# EAGLE design mercedes_shield_v1_ (EAGLE 5.11)
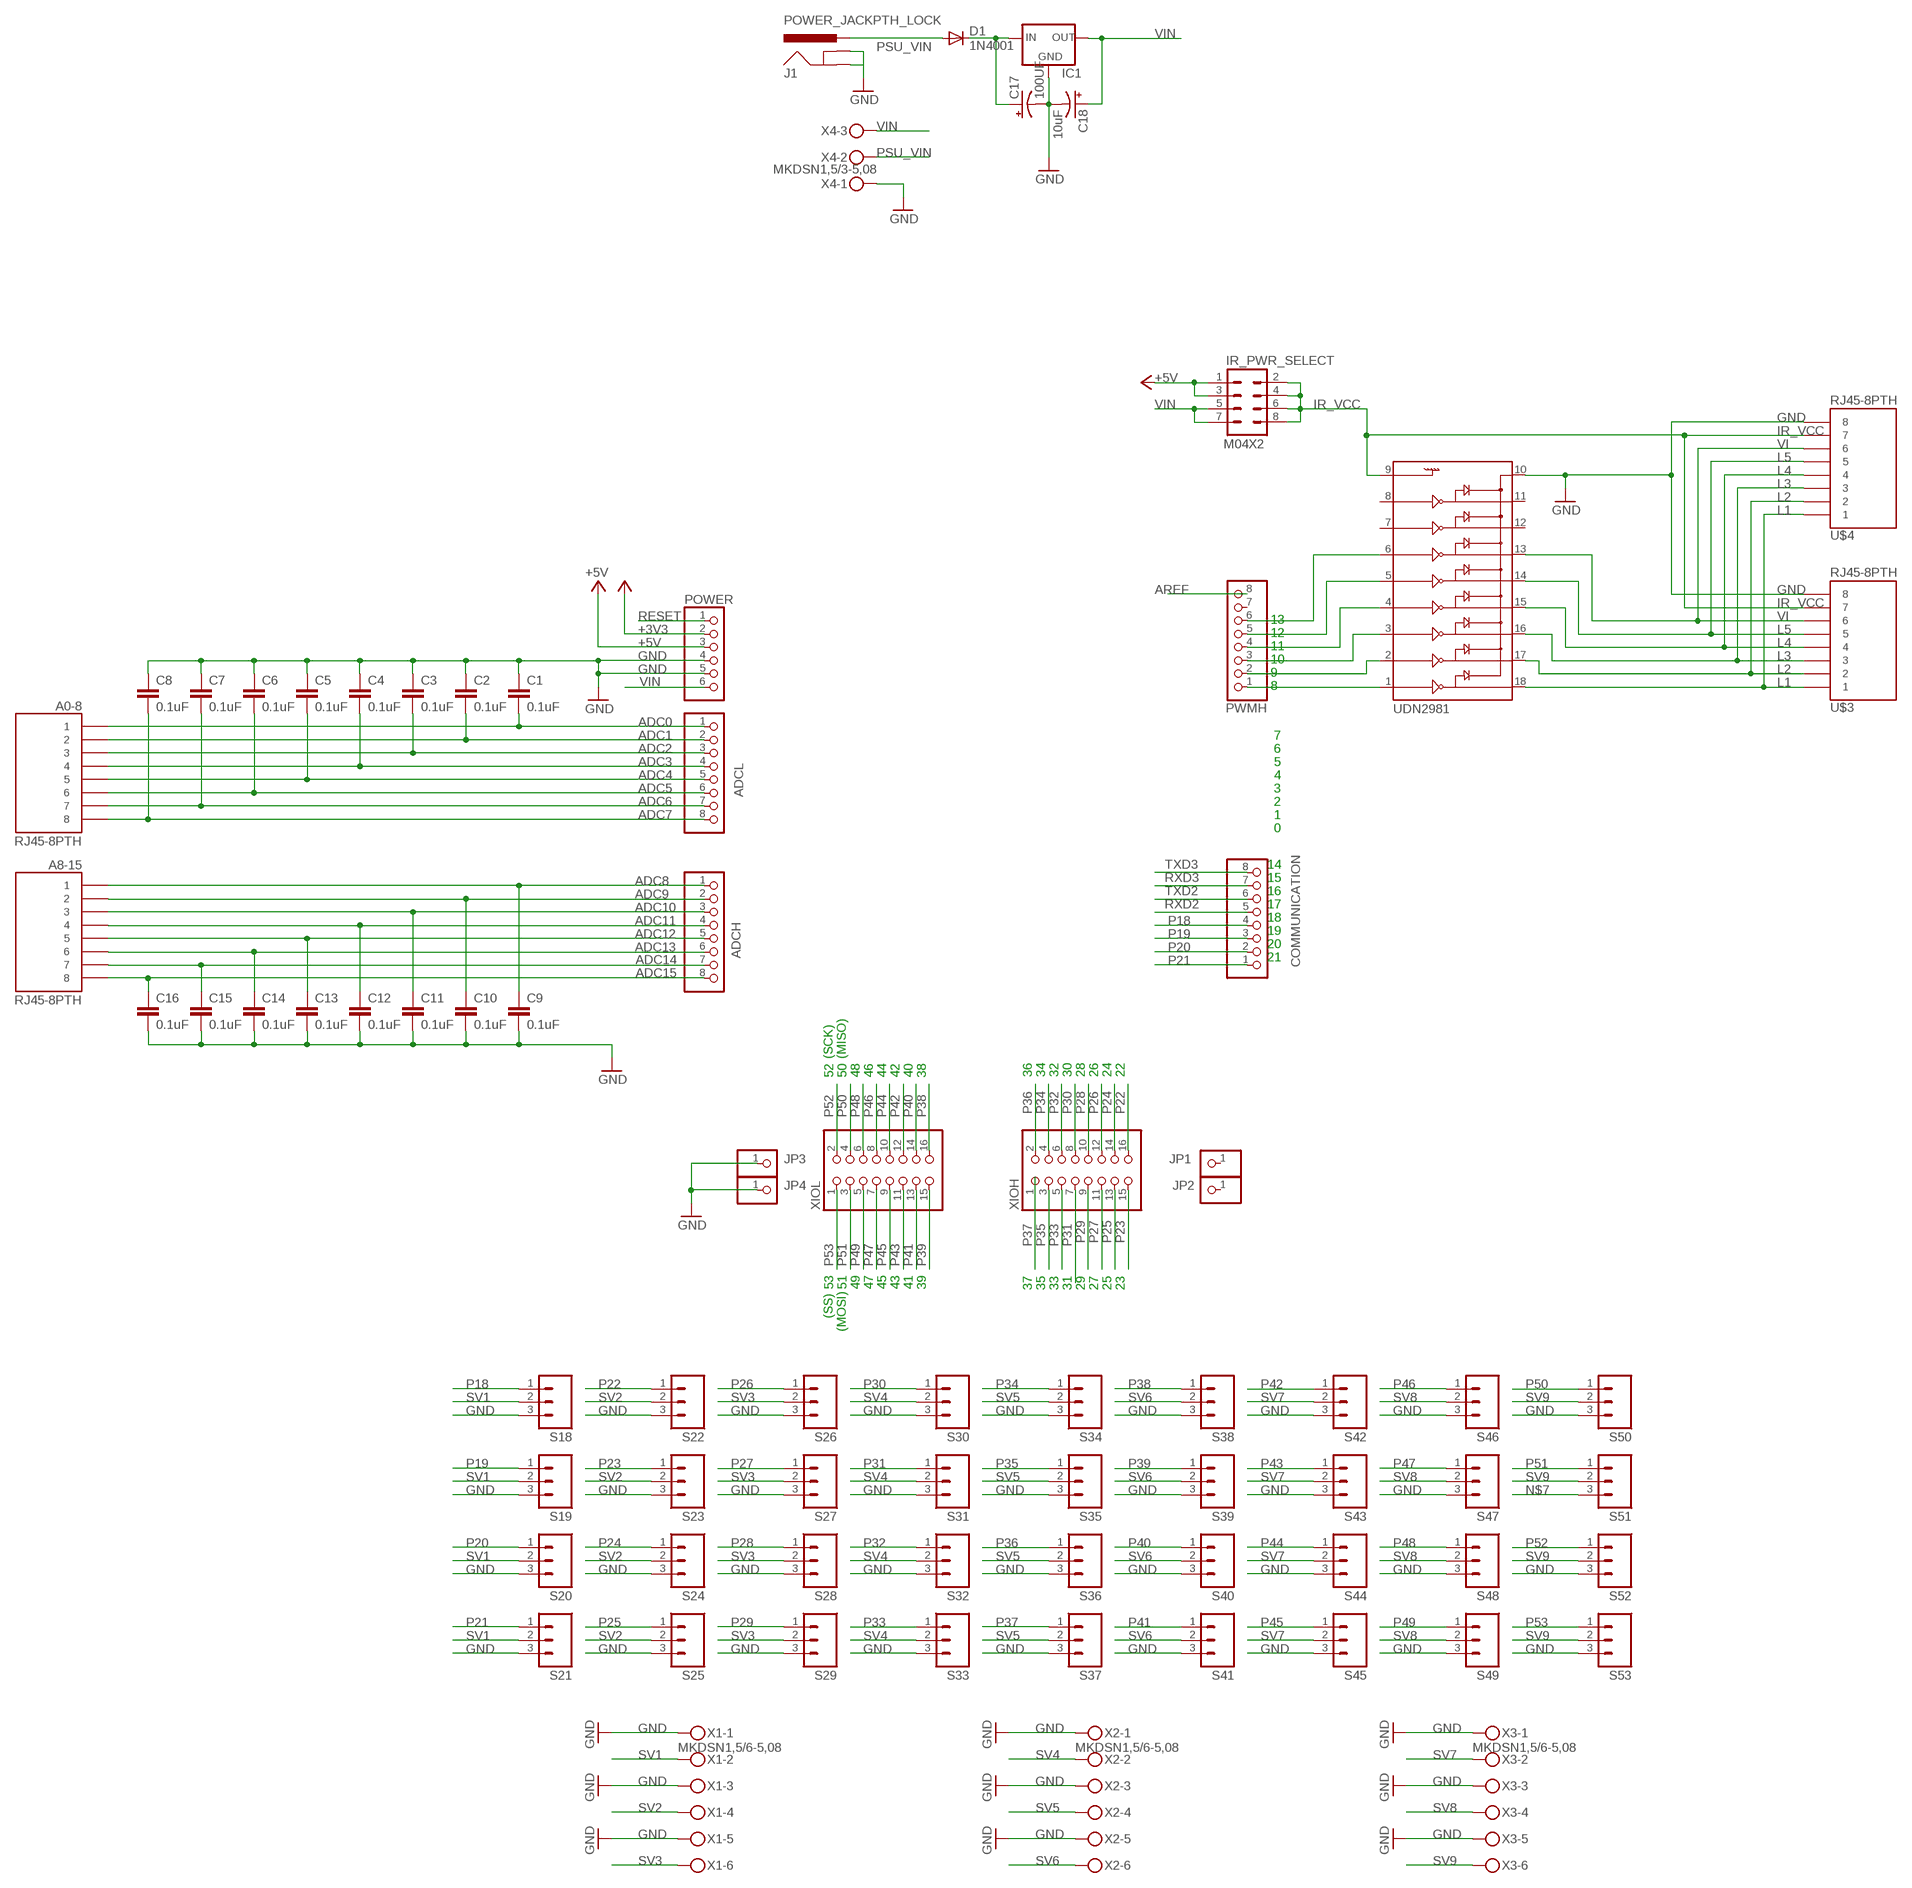
[diagram p0: schematic, sheet 1]

## Parts
A0-8  RJ45-8PTH  [RJ45-8]
A8-15  RJ45-8PTH  [RJ45-8]
ADCH  PINHD-1X8  [1X08]
ADCL  PINHD-1X8  [1X08]
C1  0.1uF  CAPPTH  [CAP-PTH-SMALL]
C2  0.1uF  CAPPTH  [CAP-PTH-SMALL]
C3  0.1uF  CAPPTH  [CAP-PTH-SMALL]
C4  0.1uF  CAPPTH  [CAP-PTH-SMALL]
C5  0.1uF  CAPPTH  [CAP-PTH-SMALL]
C6  0.1uF  CAPPTH  [CAP-PTH-SMALL]
C7  0.1uF  CAPPTH  [CAP-PTH-SMALL]
C8  0.1uF  CAPPTH  [CAP-PTH-SMALL]
C9  0.1uF  CAPPTH  [CAP-PTH-SMALL]
C10  0.1uF  CAPPTH  [CAP-PTH-SMALL]
C11  0.1uF  CAPPTH  [CAP-PTH-SMALL]
C12  0.1uF  CAPPTH  [CAP-PTH-SMALL]
C13  0.1uF  CAPPTH  [CAP-PTH-SMALL]
C14  0.1uF  CAPPTH  [CAP-PTH-SMALL]
C15  0.1uF  CAPPTH  [CAP-PTH-SMALL]
C16  0.1uF  CAPPTH  [CAP-PTH-SMALL]
C17  100UF  CAP_POLPTH1  [CPOL-RADIAL-100UF-25V]
C18  10uF  CAP_POLPTH2  [CPOL-RADIAL-10UF-25V]
COMMUNICATION  PINHD-1X8  [1X08]
D1  1N4001  DIODESMA  [SMA-DIODE]
IC1  V_REG_78XX-TO-220  [TO-220-ALT]
IR_PWR_SELECT  M04X2  [2X4]
J1  POWER_JACKPTH_LOCK  [POWER_JACK_PTH_LOCK]
JP1  PINHD-1X1  [1X01]
JP2  PINHD-1X1  [1X01]
JP3  PINHD-1X1  [1X01]
JP4  PINHD-1X1  [1X01]
POWER  PINHD-1X6  [1X06]
PWMH  PINHD-1X8  [1X08]
S18  M03PTH  [1X03]
S19  M03PTH  [1X03]
S20  M03PTH  [1X03]
S21  M03PTH  [1X03]
S22  M03PTH  [1X03]
S23  M03PTH  [1X03]
S24  M03PTH  [1X03]
S25  M03PTH  [1X03]
S26  M03PTH  [1X03]
S27  M03PTH  [1X03]
S28  M03PTH  [1X03]
S29  M03PTH  [1X03]
S30  M03PTH  [1X03]
S31  M03PTH  [1X03]
S32  M03PTH  [1X03]
S33  M03PTH  [1X03]
S34  M03PTH  [1X03]
S35  M03PTH  [1X03]
S36  M03PTH  [1X03]
S37  M03PTH  [1X03]
S38  M03PTH  [1X03]
S39  M03PTH  [1X03]
S40  M03PTH  [1X03]
S41  M03PTH  [1X03]
S42  M03PTH  [1X03]
S43  M03PTH  [1X03]
S44  M03PTH  [1X03]
S45  M03PTH  [1X03]
S46  M03PTH  [1X03]
S47  M03PTH  [1X03]
S48  M03PTH  [1X03]
S49  M03PTH  [1X03]
S50  M03PTH  [1X03]
S51  M03PTH  [1X03]
S52  M03PTH  [1X03]
S53  M03PTH  [1X03]
U$3  RJ45-8PTH  [RJ45-8]
U$4  RJ45-8PTH  [RJ45-8]
UDN2981  ULN2803DIP  [DIL18]
X1  MKDSN1,5/6-5,08  [MKDSN1,5/6-5,08]
X2  MKDSN1,5/6-5,08  [MKDSN1,5/6-5,08]
X3  MKDSN1,5/6-5,08  [MKDSN1,5/6-5,08]
X4  MKDSN1,5/3-5,08  [MKDSN1,5/3-5,08]
XIOH  PINHD-2X8  [2X08]
XIOL  PINHD-2X8  [2X08]

## Nets
+3V3: POWER.2
+5V: IR_PWR_SELECT.1 IR_PWR_SELECT.3 POWER.3
ADC0: A0-8.1 ADCL.1 C1.2
ADC1: A0-8.2 ADCL.2 C2.2
ADC2: A0-8.3 ADCL.3 C3.2
ADC3: A0-8.4 ADCL.4 C4.2
ADC4: A0-8.5 ADCL.5 C5.2
ADC5: A0-8.6 ADCL.6 C6.2
ADC6: A0-8.7 ADCL.7 C7.2
ADC7: A0-8.8 ADCL.8 C8.2
ADC8: A8-15.1 ADCH.1 C9.1
ADC9: A8-15.2 ADCH.2 C10.1
ADC10: A8-15.3 ADCH.3 C11.1
ADC11: A8-15.4 ADCH.4 C12.1
ADC12: A8-15.5 ADCH.5 C13.1
ADC13: A8-15.6 ADCH.6 C14.1
ADC14: A8-15.7 ADCH.7 C15.1
ADC15: A8-15.8 ADCH.8 C16.1
AREF: PWMH.8
GND: C1.1 C2.1 C3.1 C4.1 C5.1 C6.1 C7.1 C8.1 C9.2 C10.2 C11.2 C12.2 C13.2 C14.2 C15.2 C16.2 C17.2(-) C18.2(-) IC1.GND J1.GND J1.GNDBREAK JP3.1 JP4.1 POWER.4 POWER.5 S18.3 S19.3 S20.3 S21.3 S22.3 S23.3 S24.3 S25.3 S26.3 S27.3 S28.3 S29.3 S30.3 S31.3 S32.3 S33.3 S34.3 S35.3 S36.3 S37.3 S38.3 S39.3 S40.3 S41.3 S42.3 S43.3 S44.3 S45.3 S46.3 S47.3 S48.3 S49.3 S50.3 S52.3 S53.3 U$3.8 U$4.8 UDN2981.10 X1.1 X1.3 X1.5 X2.1 X2.3 X2.5 X3.1 X3.3 X3.5 X4.1
IR_VCC: IR_PWR_SELECT.2 IR_PWR_SELECT.4 IR_PWR_SELECT.6 IR_PWR_SELECT.8 U$3.7 U$4.7 UDN2981.9
L1: U$3.1 U$4.1 UDN2981.18
L2: U$3.2 U$4.2 UDN2981.17
L3: U$3.3 U$4.3 UDN2981.16
L4: U$3.4 U$4.4 UDN2981.15
L5: U$3.5 U$4.5 UDN2981.14
N$1: PWMH.1 UDN2981.1
N$2: PWMH.2 UDN2981.2
N$3: PWMH.3 UDN2981.3
N$4: PWMH.4 UDN2981.4
N$5: PWMH.5 UDN2981.5
N$6: PWMH.6 UDN2981.6
N$7: S51.3
N$10: C17.1(+) D1.C IC1.IN
P18: COMMUNICATION.4 S18.1
P19: COMMUNICATION.3 S19.1
P20: COMMUNICATION.2 S20.1
P21: COMMUNICATION.1 S21.1
P22: S22.1 XIOH.16
P23: S23.1 XIOH.15
P24: S24.1 XIOH.14
P25: S25.1 XIOH.13
P26: S26.1 XIOH.12
P27: S27.1 XIOH.11
P28: S28.1 XIOH.10
P29: S29.1 XIOH.9
P30: S30.1 XIOH.8
P31: S31.1 XIOH.7
P32: S32.1 XIOH.6
P33: S33.1 XIOH.5
P34: S34.1 XIOH.4
P35: S35.1 XIOH.3
P36: S36.1 XIOH.2
P37: S37.1 XIOH.1
P38: S38.1 XIOL.16
P39: S39.1 XIOL.15
P40: S40.1 XIOL.14
P41: S41.1 XIOL.13
P42: S42.1 XIOL.12
P43: S43.1 XIOL.11
P44: S44.1 XIOL.10
P45: S45.1 XIOL.9
P46: S46.1 XIOL.8
P47: S47.1 XIOL.7
P48: S48.1 XIOL.6
P49: S49.1 XIOL.5
P50: S50.1 XIOL.4
P51: S51.1 XIOL.3
P52: S52.1 XIOL.2
P53: S53.1 XIOL.1
PSU_VIN: D1.A J1.PWR X4.2
RESET: POWER.1
RXD2: COMMUNICATION.5
RXD3: COMMUNICATION.7
SV1: S18.2 S19.2 S20.2 S21.2 X1.2
SV2: S22.2 S23.2 S24.2 S25.2 X1.4
SV3: S26.2 S27.2 S28.2 S29.2 X1.6
SV4: S30.2 S31.2 S32.2 S33.2 X2.2
SV5: S34.2 S35.2 S36.2 S37.2 X2.4
SV6: S38.2 S39.2 S40.2 S41.2 X2.6
SV7: S42.2 S43.2 S44.2 S45.2 X3.2
SV8: S46.2 S47.2 S48.2 S49.2 X3.4
SV9: S50.2 S51.2 S52.2 S53.2 X3.6
TXD2: COMMUNICATION.6
TXD3: COMMUNICATION.8
VI: U$3.6 U$4.6 UDN2981.13
VIN: C18.1(+) IC1.OUT IR_PWR_SELECT.5 IR_PWR_SELECT.7 POWER.6 X4.3
Unconnected: JP1.1 JP2.1 PWMH.7 UDN2981.7 UDN2981.8 UDN2981.11 UDN2981.12

## Notes on the sheet
- 13
- 12
- 11
- 10
- 9
- 8
- 7
- 6
- 5
- 4
- 3
- 2
- 1
- 0
- 14
- 15
- 16
- 17
- 18
- 19
- 20
- 21
- (SCK) | (MISO)
- 52 | 50 | 48 | 46 | 44 | 42 | 40 | 38 | 36 | 34 | 32 | 30 | 28 | 26 | 24 | 22
- 53 | 51 | 49 | 47 | 45 | 43 | 41 | 39 | 37 | 35 | 33 | 31 | 29 | 27 | 25 | 23
- (SS)
- (MOSI)

## Library data of the parts
A0-8 A8-15 U$3 U$4 = SparkFun:RJ45-8: RJ45 Jack Simple RJ45, 8-pin connection - connector for common Cat5, Cat5e, and Cat6 Ethernet cables. Footprint not yet proven in production. Connector sku is PRT-00643; Breakout PCB sku is BOB-00716.
ADCH ADCL COMMUNICATION PWMH = pinhead:PINHD-1X8: PIN HEADER
C1-C16 = SparkFun:CAP: Capacitor Standard 0603 ceramic capacitor, and 0.1" leaded capacitor.
C17 C18 = SparkFun:CAP_POL: Capacitor Polarized These are standard SMD and PTH capacitors. Normally 10uF, 47uF, and 100uF in electrolytic and tantalum varieties. Always verify the external diameter of the through hole cap, it varies with capacity, voltage, and manufacturer. The EIA devices should be standard.
D1 = SparkFun:DIODE: Diode These are standard reverse protection diodes and small signal diodes. SMA package can handle up to about 1A. SOD-323 can handle about 200mA. What the SOD-323 package when ordering, there are some mfgs out there that are 5-pin packages.
IC1 = SparkFun:V_REG_78XX: Voltage Regulator Standard 7805 5V regulator. IGO (Input Ground Output). Spark Fun Electronics SKU : COM-00107
IR_PWR_SELECT = SparkFun:M04X2
J1 = SparkFun:POWER_JACK: Power Jack This is the standard 5.5mm barrel jack for power. The PTH is the most common, proven, reliable, footprint. All others are experimental. The Slot footprint only works if the mill layer is transmitted to the PCB fab house so be warned. Spark Fun Electronics SKU : PRT-00119. Mating wall wart : TOL-00298 (and others)
JP1-JP4 = pinhead:PINHD-1X1: PIN HEADER
POWER = pinhead:PINHD-1X6: PIN HEADER
S18-S53 = SparkFun:M03: Header 3 Standard 3-pin 0.1" header. Use with straight break away headers (SKU : PRT-00116), right angle break away headers (PRT-00553), swiss pins (PRT-00743), machine pins (PRT-00117), and female headers (PRT-00115). Molex polarized connector foot print use with SKU : PRT-08232 with associated crimp pins and housings.
UDN2981 = SparkFun:ULN2803: Darlington Driver ULN2803 Darlington array. 500mA max per channel, 8-channel package. Spark Fun Electronics SKU : COM-00312
X1-X3 = con-phoenix-508:MKDSN1,5/6-5,08: MKDSN 1,5/ 6-5,08 Printklemme Nennstrom: 13,5 A Nennspannung: 250 V Rastermaß: 5,08 mm Polzahl: 6 Anschlussart: Schraubanschluss Montage: Löten Anschlussrichtung Leiter/Platine: 0 ° Artikelnummer: 1729160 Source: http://eshop.phoenixcontact.com .. 1729160.pdf; MPN: SMKDSN1,5/6-5,08; OC_FARNELL: 1792907; OC_NEWARK: 70R0302
X4 = con-phoenix-508:MKDSN1,5/3-5,08: MKDSN 1,5/ 3-5,08 Printklemme Nennstrom: 13,5 A Nennspannung: 250 V Rastermaß: 5,08 mm Polzahl: 3 Anschlussart: Schraubanschluss Montage: Löten Anschlussrichtung Leiter/Platine: 0 ° Artikelnummer: 1729131 Source: http://eshop.phoenixcontact.com .. 1729131.pdf; MPN: SMKDSN1,5/3-5,08; OC_FARNELL: 1792904; OC_NEWARK: 70R0299
XIOH XIOL = pinhead:PINHD-2X8: PIN HEADER

## Net classes
0 default: width 0.152 mm, drill 0.305 mm, clearance 0.152 mm

## Board
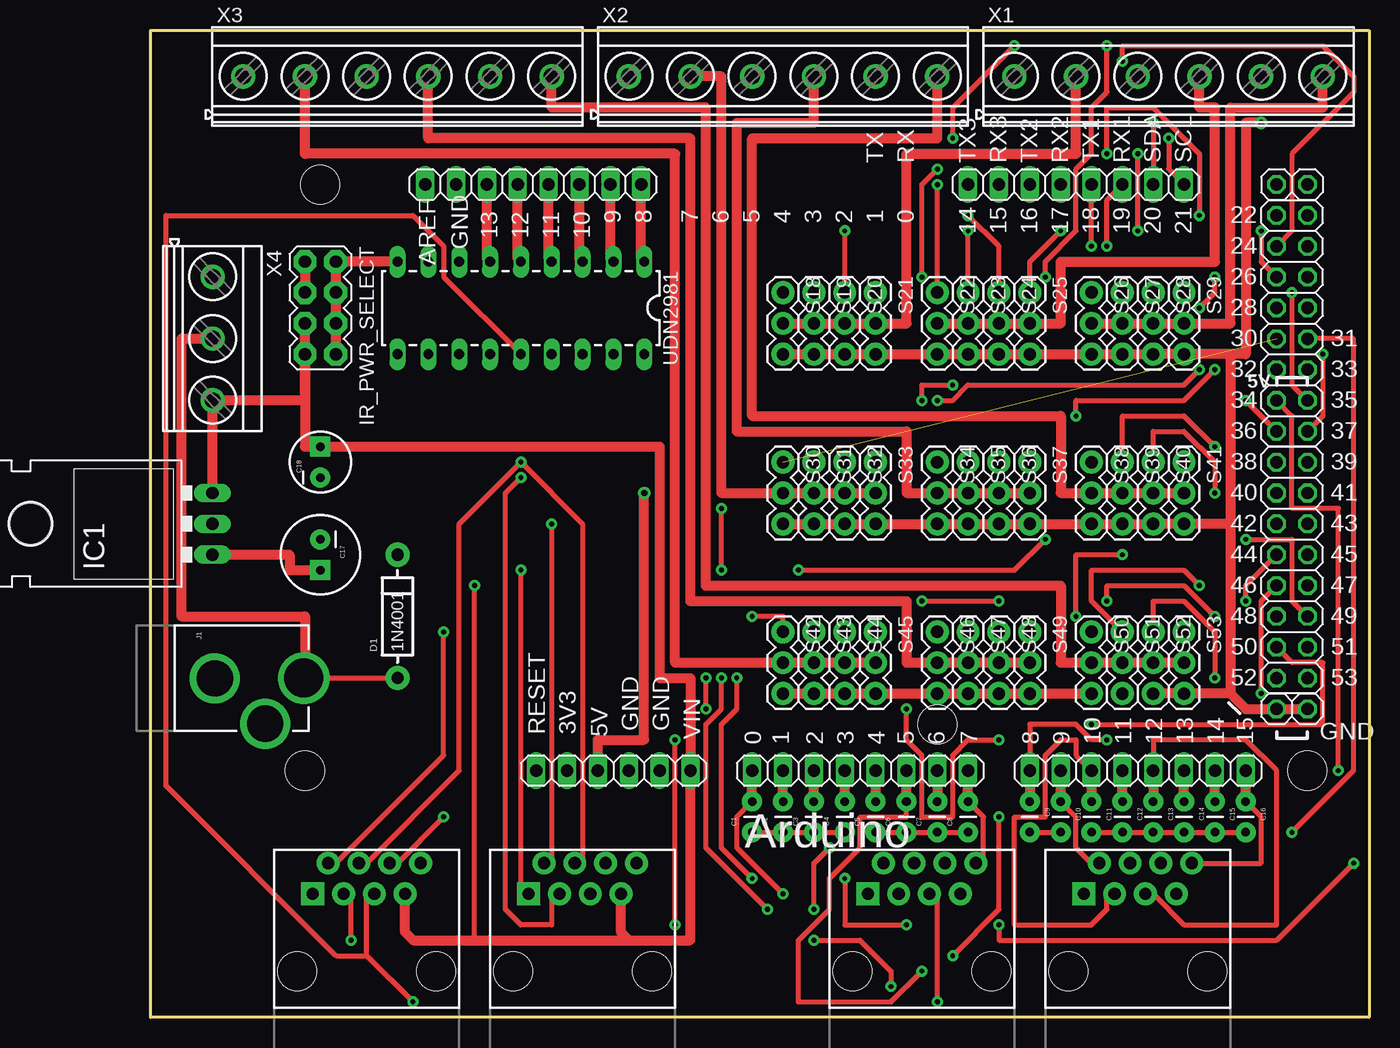
[diagram p1: board, top side]
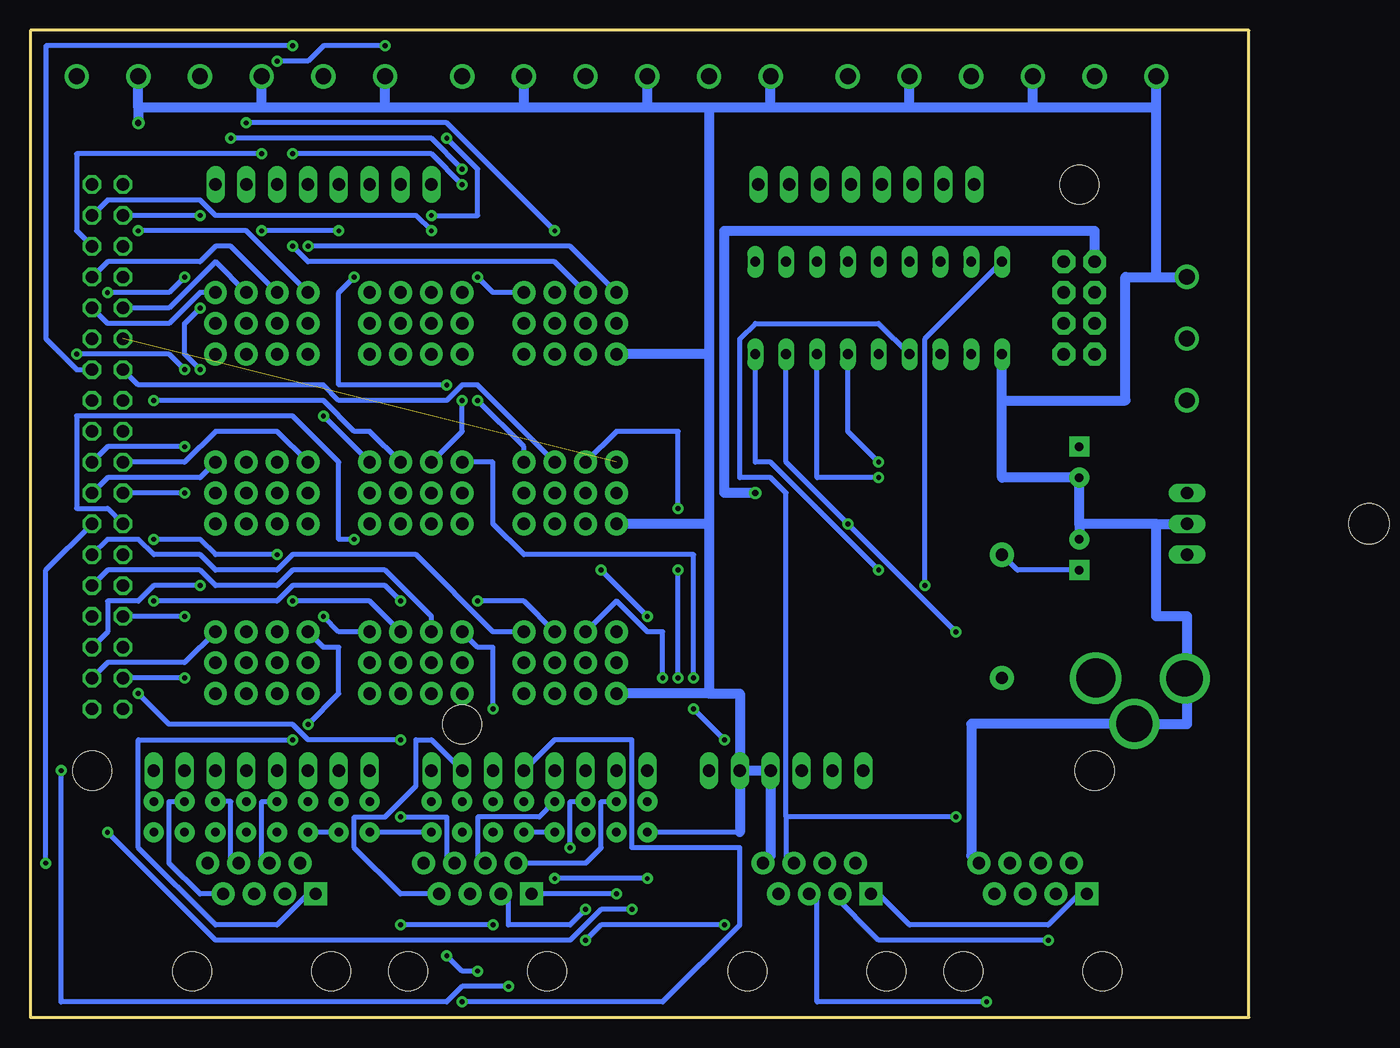
[diagram p2: board, bottom side, seen from below]

Size 100.33 x 81.28 mm. Coordinates in mm from the lower left corner, seen from the top.
Outline: 0,81.28 100.33,81.28 100.33,0 0,0 0,81.28
Copper layers (1*16): Top 0.035mm / dielectric 1.5mm / Bottom 0.035mm
Design rules "pcbtrain *": minimum track width 0.4mm, minimum drill 0.4mm, track to track 0.2mm, track to pad 0.2mm, pad to pad 0.2mm, via to via 0.2mm, smd to smd 0mil, copper to edge 10mil, drill to drill 0.2mm, minimum pad ring 10mil, minimum via ring 10mil, stop-mask expansion 0.125mm, vias tented up to drill 0mil, thermal gap 10mil
Holes 3.2 mm at 95.25,20.32 13.97,68.58 12.7,20.32 64.77,24.13

### Footprints (pad centres in the part's own frame; a part is rotated, then mirrored left to right if it is on the bottom)
RJ45-8 = drill 1 pad 1.88 square: 1 -4.445,6.35 | drill 1 pad 1.88 round: 2 -3.175,8.89; 3 -1.905,6.35; 4 -0.635,8.89; 5 0.635,6.35; 6 1.905,8.89; 7 3.175,6.35; 8 4.445,8.89 | hole 3.2: -5.715,0; 5.715,0
1X08 = drill 1.016 long: 1 -8.89,0; 2 -6.35,0; 3 -3.81,0; 4 -1.27,0; 5 1.27,0; 6 3.81,0; 7 6.35,0; 8 8.89,0
CAP-PTH-SMALL = drill 0.7 pad 1.651 round: 1 0,0; 2 2.54,0
CPOL-RADIAL-100UF-25V = drill 0.7 pad 1.651 square: 1 1.27,0 | drill 0.7 pad 1.651 round: 2 -1.27,0
CPOL-RADIAL-10UF-25V = drill 0.7 pad 1.651 square: 1 1.27,0 | drill 0.7 pad 1.651 round: 2 -1.27,0
DIODE-1N4001 = drill 1 pad 1.981 round: A -5.08,0; C 5.08,0
TO-220-ALT = drill 1.016 long: GND 0,-3.81; IN -2.54,-3.81; OUT 2.54,-3.81 | hole 3.302: 0,11.176
2X4 = drill 1.016 pad 1.88 octagon: 1 -3.81,-1.27; 2 -3.81,1.27; 3 -1.27,-1.27; 4 -1.27,1.27; 5 1.27,-1.27; 6 1.27,1.27; 7 3.81,-1.27; 8 3.81,1.27
POWER_JACK_PTH_LOCK = drill 2.997 pad 4.115 round: GND 0.025,6.557; GNDBREAK 3.762,10.7 | drill 3.2 pad 4.115 round: PWR 0,13.878
1X01 = drill 1.016 octagon: 1 0,0
1X06 = drill 1.016 long: 1 -6.35,0; 2 -3.81,0; 3 -1.27,0; 4 1.27,0; 5 3.81,0; 6 6.35,0
1X03 = drill 1.016 pad 1.88 round: 1 0,0; 2 2.54,0; 3 5.08,0
DIL18 = drill 0.813 long: 1 -10.16,-3.81; 2 -7.62,-3.81; 3 -5.08,-3.81; 4 -2.54,-3.81; 5 0,-3.81; 6 2.54,-3.81; 7 5.08,-3.81; 8 7.62,-3.81; 9 10.16,-3.81; 10 10.16,3.81; 11 7.62,3.81; 12 5.08,3.81; 13 2.54,3.81; 14 0,3.81; 15 -2.54,3.81; 16 -5.08,3.81; 17 -7.62,3.81; 18 -10.16,3.81
MKDSN1,5/6-5,08 = drill 1.3 pad 2 round: 1 -12.7,0.025; 2 -7.62,0.025; 3 -2.54,0.025; 4 2.54,0.025; 5 7.62,0.025; 6 12.7,0.025
MKDSN1,5/3-5,08 = drill 1.3 pad 2 round: 1 -7.641,0.025; 2 -2.561,0.025; 3 2.519,0.025
2X08 = drill 1.016 octagon: 1 -8.89,-1.27; 2 -8.89,1.27; 3 -6.35,-1.27; 4 -6.35,1.27; 5 -3.81,-1.27; 6 -3.81,1.27; 7 -1.27,-1.27; 8 -1.27,1.27; 9 1.27,-1.27; 10 1.27,1.27; 11 3.81,-1.27; 12 3.81,1.27; 13 6.35,-1.27; 14 6.35,1.27; 15 8.89,-1.27; 16 8.89,1.27

### Placement (x,y rotation side)
A0-8  63.5,3.81 0 top
A8-15  81.28,3.81 0 top
ADCH  81.28,20.32 0 top
ADCL  58.42,20.32 0 top
C1  49.53,15.24 90 top
C2  52.07,15.24 90 top
C3  54.61,15.24 90 top
C4  57.15,15.24 90 top
C5  59.69,15.24 90 top
C6  62.23,15.24 90 top
C7  64.77,15.24 90 top
C8  67.31,15.24 90 top
C9  72.39,17.78 270 top
C10  74.93,17.78 270 top
C11  77.47,17.78 270 top
C12  80.01,17.78 270 top
C13  82.55,17.78 270 top
C14  85.09,17.78 270 top
C15  87.63,17.78 270 top
C16  90.17,17.78 270 top
C17  13.97,38.1 270 top
C18  13.97,45.72 90 top
COMMUNICATION  76.2,68.58 180 top
D1  1N4001  [DIODE-1N4001]  20.32,33.02 90 top
IC1  1.27,40.64 90 top
IR_PWR_SELECT  13.97,58.42 270 top
J1  -1.27,27.94 270 top
JP1  92.71,68.58 0 top
JP2  95.25,68.58 0 top
JP3  92.71,25.4 0 top
JP4  95.25,25.4 0 top
POWER  38.1,20.32 0 top
PWMH  31.5,68.58 180 top
S18  52.07,59.69 270 top
S19  54.61,59.69 270 top
S20  57.15,59.69 270 top
S21  59.69,59.69 270 top
S22  64.77,59.69 270 top
S23  67.31,59.69 270 top
S24  69.85,59.69 270 top
S25  72.39,59.69 270 top
S26  77.47,59.69 270 top
S27  80.01,59.69 270 top
S28  82.55,59.69 270 top
S29  85.09,59.69 270 top
S30  52.07,45.72 270 top
S31  54.61,45.72 270 top
S32  57.15,45.72 270 top
S33  59.69,45.72 270 top
S34  64.77,45.72 270 top
S35  67.31,45.72 270 top
S36  69.85,45.72 270 top
S37  72.39,45.72 270 top
S38  77.47,45.72 270 top
S39  80.01,45.72 270 top
S40  82.55,45.72 270 top
S41  85.09,45.72 270 top
S42  52.07,31.75 270 top
S43  54.61,31.75 270 top
S44  57.15,31.75 270 top
S45  59.69,31.75 270 top
S46  64.77,31.75 270 top
S47  67.31,31.75 270 top
S48  69.85,31.75 270 top
S49  72.39,31.75 270 top
S50  77.47,31.75 270 top
S51  80.01,31.75 270 top
S52  82.55,31.75 270 top
S53  85.09,31.75 270 top
U$3  35.56,3.81 0 top
U$4  17.78,3.81 0 top
UDN2981  30.48,58.42 180 top
X1  83.82,77.47 0 top
X2  52.07,77.47 0 top
X3  20.32,77.47 0 top
X4  5.08,53.34 270 top
XIOH  93.98,57.15 90 top
XIOL  93.98,36.83 90 top

### Tracks (layer width: path | path; a pad name or v marks a point on that pad's centre or on a via)
+5V  (via drill 0.51)
  Top 0.813: IR_PWR_SELECT.1 IR_PWR_SELECT.3 | POWER.3 36.83,22.86 40.64,22.86 v40.64,43.18
  Bottom 0.813: v40.64,43.18 43.18,43.18 43.18,64.77 12.7,64.77 IR_PWR_SELECT.1
ADC0  (via drill 0.4)
  Top 0.4: v52.07,10.16 48.26,13.97 48.26,16.51 C1.2
  Top 0.813: C1.2 ADCL.1
  Bottom 0.4: v52.07,10.16 A0-8.1
ADC1
  Top 0.813: C2.2 ADCL.2
  Bottom 0.4: C2.2 53.34,17.78 53.34,13.97 54.61,12.7 A0-8.2
ADC2  (via drill 0.4)
  Top 0.4: v54.61,8.89 54.61,12.7 v55.88,13.97
  Top 0.813: C3.2 ADCL.3
  Bottom 0.4: v54.61,8.89 55.88,7.62 60.96,7.62 60.96,10.16 A0-8.3 | v55.88,13.97 55.88,17.78 C3.2
ADC3
  Top 0.813: C4.2 ADCL.4
  Bottom 0.4: C4.2 58.42,16.51 63.5,16.51 63.5,12.7 A0-8.4
ADC4  (via drill 0.4)
  Top 0.4: v64.77,1.27 64.77,10.16 A0-8.5
  Top 0.813: ADCL.5 C5.2
  Bottom 0.4: v64.77,1.27 48.26,1.27 41.91,7.62 41.91,13.97 50.8,13.97 50.8,22.86 57.15,22.86 ADCL.5
ADC5  (via drill 0.4)
  Top 0.4: v69.85,16.51 69.85,8.89 v66.04,5.08 | v63.5,3.81 60.96,1.27 53.34,1.27 53.34,6.35 55.88,8.89 55.88,11.43 58.42,13.97 58.42,16.51 62.23,16.51 C6.2
  Top 0.813: C6.2 ADCL.6
  Bottom 0.4: v69.85,16.51 66.04,16.51 66.04,12.7 A0-8.6 | v66.04,5.08 64.77,3.81 v63.5,3.81
ADC6
  Top 0.813: ADCL.7 C7.2
  Bottom 0.4: ADCL.7 67.31,22.86 68.58,22.86 68.58,19.05 71.12,16.51 73.66,16.51 73.66,13.97 69.85,10.16 A0-8.7
ADC7
  Top 0.4: C8.2 68.58,16.51 68.58,12.7 A0-8.8
  Top 0.813: C8.2 ADCL.8
ADC8  (via drill 0.4)
  Top 0.4: v78.74,22.86 77.47,22.86 76.2,24.13 72.39,24.13 ADCH.1
  Top 0.813: ADCH.1 C9.1
  Bottom 0.4: v78.74,22.86 91.44,22.86 91.44,13.97 85.09,7.62 80.01,7.62 77.47,10.16 A8-15.1
ADC9
  Top 0.4: C10.1 76.2,16.51 76.2,13.97 77.47,12.7 A8-15.2
  Top 0.813: C10.1 ADCH.2
ADC10
  Top 0.4: ADCH.3 76.2,21.59 76.2,22.86 74.93,22.86 73.66,21.59 73.66,16.51 71.12,16.51 71.12,7.62 77.47,7.62 78.74,8.89 78.74,10.16 A8-15.3
  Top 0.813: ADCH.3 C11.1
ADC11
  Top 0.813: C12.1 ADCH.4
  Bottom 0.4: C12.1 81.28,17.78 81.28,12.7 A8-15.4
ADC12
  Top 0.4: ADCH.5 82.55,22.86 90.17,22.86 92.71,20.32 92.71,7.62 85.09,7.62 82.55,10.16 A8-15.5
  Top 0.813: ADCH.5 C13.1
ADC13
  Top 0.813: C14.1 ADCH.6
  Bottom 0.4: C14.1 83.82,17.78 83.82,12.7 A8-15.6
ADC14
  Top 0.813: C15.1 ADCH.7
  Bottom 0.4: C15.1 88.9,17.78 88.9,12.7 86.36,10.16 A8-15.7
ADC15
  Top 0.4: C16.1 91.44,16.51 91.44,12.7 A8-15.8
  Top 0.813: C16.1 ADCH.8
GND  (via drill 0.51)
  Top 0.254: S24.3 S23.3 | X3.1 7.62,77.47 | X1.1 71.12,77.47
  Top 0.4: C1.1 C2.1 C3.1 C4.1 | C5.1 C6.1 C7.1 C8.1 | C9.2 C10.2 | C11.2 C12.2 C13.2 C14.2 C15.2 C16.2
  Top 0.813: S18.3 S19.3 S20.3 S21.3 S22.3 S24.3 S25.3 S26.3 S27.3 S28.3 S29.3 88.9,54.61 | S30.3 S31.3 S32.3 S33.3 S34.3 S35.3 S36.3 S37.3 S38.3 S39.3 S40.3 S41.3 88.9,40.64 | S52.3 S53.3 88.9,26.67 | S50.3 S49.3 S48.3 S47.3 S46.3 S45.3 S44.3 S43.3 S42.3 | 88.9,26.67 90.17,25.4 JP3.1 JP4.1 | 88.9,54.61 88.9,40.64 | 88.9,40.64 88.9,26.67 | 88.9,54.61 90.17,54.61 90.17,73.66 v91.44,73.66
  Bottom 0.4: C4.1 C5.1 | C10.2 C11.2 | C8.1 C9.2 | 41.91,15.24 C1.1
  Bottom 0.813: 7.62,74.93 X3.1 | 7.62,74.93 17.78,74.93 | 17.78,74.93 X3.3 | 17.78,74.93 27.94,74.93 | 39.37,74.93 X2.1 | 44.45,74.93 49.53,74.93 | 49.53,74.93 X2.3 | 49.53,74.93 59.69,74.93 | 59.69,74.93 X2.5 | 59.69,74.93 71.12,74.93 | 71.12,74.93 X1.1 | 71.12,74.93 81.28,74.93 | 81.28,74.93 X1.3 | 81.28,74.93 91.44,74.93 | 91.44,74.93 X1.5 | 27.94,74.93 X3.5 | 39.37,74.93 44.45,74.93 | 27.94,74.93 39.37,74.93 | 44.45,40.64 44.45,26.67 | 44.45,54.61 44.45,40.64 | 44.45,74.93 44.45,54.61 | 44.45,26.67 S42.3 | 44.45,40.64 S30.3 | 44.45,54.61 S18.3 | 91.44,74.93 v91.44,73.66 | 44.45,26.67 41.91,26.67 POWER.5 | POWER.5 POWER.4 39.37,13.34 U$3.8 | 7.62,60.96 7.62,74.93 | 7.62,60.96 5.13,60.96 X4.1 | 7.62,40.64 IC1.GND | 7.62,40.64 13.97,40.64 | 13.97,40.64 C17.2 | 13.97,40.64 C18.2 20.32,44.45 20.32,50.8 | 5.08,27.94 5.08,33.02 7.62,33.02 7.62,40.64 | 20.32,50.8 UDN2981.10 | 20.32,50.8 10.16,50.8 10.16,60.96 7.62,60.96 | J1.GND 5.11,27.91 5.08,27.94 | 5.08,27.94 5.08,24.13 9.38,24.13 J1.GNDBREAK 22.81,24.18 22.86,24.13 22.86,13.34 U$4.8 | POWER.5 41.91,15.24
IR_VCC  (via drill 0.4)
  Top 0.4: 26.67,6.35 v26.67,35.56
  Top 0.813: IR_PWR_SELECT.8 IR_PWR_SELECT.6 IR_PWR_SELECT.4 IR_PWR_SELECT.2 UDN2981.9 | U$4.7 20.96,6.99 21.59,6.35 26.67,6.35 39.37,6.35 | 39.37,6.35 44.45,6.35 44.45,20.32 | U$3.7 38.73,6.99 39.37,6.35
  Bottom 0.4: UDN2981.9 26.67,55.88 v26.67,35.56
L1  (via drill 0.4)
  Top 0.4: v30.48,36.83 30.48,10.16 U$3.1
  Bottom 0.4: UDN2981.18 40.64,45.72 39.37,45.72 v30.48,36.83 | U$4.1 13.97,10.16 16.51,7.62 27.94,7.62 30.48,10.16 U$3.1
L2  (via drill 0.4)
  Top 0.4: v33.02,40.64 33.02,12.7 U$3.2 | v24.13,31.75 24.13,21.59 15.24,12.7 U$4.2
  Bottom 0.4: UDN2981.17 38.1,45.72 v33.02,40.64 v24.13,31.75
L3  (via drill 0.4)
  Top 0.4: v30.48,44.45 29.21,43.18 29.21,8.89 30.48,7.62 33.02,7.62 33.02,10.16 U$3.3 | v16.51,6.35 16.51,10.16 U$4.3
  Bottom 0.4: UDN2981.16 35.56,44.45 v30.48,44.45 | v16.51,6.35 30.48,6.35 34.29,10.16 U$3.3
L4  (via drill 0.4)
  Top 0.4: U$3.4 35.56,12.7 35.56,40.64 v30.48,45.72 25.4,40.64 25.4,20.32 17.78,12.7 U$4.4
  Bottom 0.4: UDN2981.15 33.02,48.26 v30.48,45.72
L5  (via drill 0.4)
  Top 0.4: UDN2981.14 24.13,60.96 24.13,63.5 21.59,66.04 1.27,66.04 1.27,19.05 15.24,5.08 17.78,5.08 | 17.78,5.08 17.78,10.16 U$4.5 | 17.78,5.08 v21.59,1.27
  Bottom 0.4: v21.59,1.27 35.56,1.27 35.56,10.16 U$3.5
N$1
  Top 0.813: PWMH.1 40.39,62.48 UDN2981.1
N$2
  Top 0.813: PWMH.2 37.85,62.48 UDN2981.2
N$3
  Top 0.813: PWMH.3 35.31,62.48 UDN2981.3
N$4
  Top 0.813: PWMH.4 32.77,62.48 UDN2981.4
N$5
  Top 0.813: PWMH.5 30.23,62.48 UDN2981.5
N$6
  Top 0.813: PWMH.6 27.69,62.48 UDN2981.6
N$10
  Top 0.813: IC1.IN 11.43,38.1 11.43,36.83 C17.1
  Bottom 0.4: D1.C 19.05,36.83 C17.1
P18  (via drill 0.4)
  Top 0.4: v77.47,63.5 COMMUNICATION.4
  Bottom 0.4: v77.47,63.5 55.88,63.5 S18.1
P19  (via drill 0.4)
  Top 0.4: COMMUNICATION.3 78.74,67.31 v78.74,63.5
  Bottom 0.4: v78.74,63.5 77.47,62.23 57.15,62.23 S19.1
P20  (via drill 0.4)
  Top 0.4: v82.55,73.66 COMMUNICATION.2 | S20.1 v57.15,64.77
  Bottom 0.4: v82.55,73.66 66.04,73.66 v57.15,64.77
P21  (via drill 0.4)
  Top 0.4: COMMUNICATION.1 83.82,69.85 v83.82,72.39 | v64.77,69.85 63.5,68.58 v63.5,60.96
  Bottom 0.4: v83.82,72.39 67.31,72.39 v64.77,69.85 | v63.5,60.96 62.23,59.69 S21.1
P22  (via drill 0.4)
  Top 0.4: v86.36,66.04 86.36,71.12 82.55,74.93 78.74,74.93 v78.74,71.12 | S22.1 v64.77,68.58
  Bottom 0.4: v86.36,66.04 XIOH.16 | v78.74,71.12 67.31,71.12 v64.77,68.58
P23  (via drill 0.4)
  Top 0.4: S23.1 v67.31,64.77
  Bottom 0.4: XIOH.15 93.98,67.31 86.36,67.31 85.09,66.04 68.58,66.04 v67.31,64.77
P24  (via drill 0.4)
  Top 0.4: XIOH.14 93.98,64.77 93.98,71.12 99.06,76.2 99.06,77.47 96.52,80.01 80.01,80.01 v80.01,78.74 | v71.12,80.01 66.04,74.93 v66.04,72.39 | v67.31,66.04 69.85,63.5 S24.1
  Bottom 0.4: v80.01,78.74 77.47,78.74 76.2,80.01 v71.12,80.01 | v66.04,72.39 63.5,69.85 63.5,66.04 v67.31,66.04
P25  (via drill 0.4)
  Top 0.4: v81.28,64.77 v81.28,71.12 | v74.93,64.77 72.39,62.23 S25.1
  Bottom 0.4: XIOH.13 96.52,64.77 96.52,71.12 v81.28,71.12 | v74.93,64.77 v81.28,64.77
P26  (via drill 0.4)
  Top 0.4: XIOH.12 91.44,62.23 v91.44,64.77
  Bottom 0.4: v91.44,64.77 82.55,64.77 S26.1
P27
  Bottom 0.4: XIOH.11 93.98,62.23 86.36,62.23 85.09,63.5 83.82,63.5 S27.1
P28
  Bottom 0.4: XIOH.10 88.9,58.42 85.09,62.23 S28.1
P29
  Bottom 0.4: XIOH.9 93.98,57.15 88.9,57.15 86.36,59.69 S29.1
P30  (1 unrouted)
P31  (via drill 0.4)
  Top 0.4: XIOH.7 99.06,55.88 99.06,20.32 v93.98,15.24 | v50.8,8.89 45.72,13.97 45.72,24.13 46.99,25.4 v46.99,27.94 | v46.99,36.83 v46.99,41.91
  Bottom 0.4: v93.98,15.24 85.09,6.35 55.88,6.35 53.34,8.89 v50.8,8.89 | v46.99,27.94 v46.99,36.83 | v46.99,41.91 46.99,48.26 52.07,48.26 S31.1
P32
  Bottom 0.4: XIOH.6 91.44,52.07 76.2,52.07 74.93,50.8 66.04,50.8 64.77,52.07 63.5,52.07 S32.1
P33  (via drill 0.4)
  Top 0.4: v78.74,80.01 78.74,76.2 77.47,74.93 77.47,71.12 76.2,69.85 76.2,64.77 73.66,62.23 v73.66,60.96 | v66.04,52.07 63.5,52.07 v63.5,50.8
  Bottom 0.4: XIOH.5 96.52,53.34 99.06,55.88 99.06,80.01 v78.74,80.01 | v73.66,60.96 74.93,59.69 74.93,52.07 v66.04,52.07 | v63.5,50.8 59.69,46.99 S33.1
P34  (via drill 0.4)
  Top 0.4: XIOH.4 93.98,49.53 93.98,41.91 97.79,41.91 v97.79,20.32 | v60.96,2.54 60.96,3.81 58.42,6.35 v54.61,6.35 | v43.18,7.62 v43.18,22.86 | v45.72,25.4 v45.72,27.94
  Bottom 0.4: v97.79,20.32 97.79,1.27 66.04,1.27 64.77,2.54 v60.96,2.54 | v54.61,6.35 53.34,7.62 v43.18,7.62 | v43.18,22.86 v45.72,25.4 | v45.72,27.94 45.72,38.1 59.69,38.1 62.23,40.64 62.23,45.72 S34.1
P35  (via drill 0.4)
  Top 0.4: XIOH.3 93.98,52.07 v93.98,59.69 | v87.63,60.96 87.63,59.69 v86.36,58.42 | v86.36,53.34 85.09,52.07 67.31,52.07 66.04,50.8 v64.77,50.8
  Bottom 0.4: v93.98,59.69 88.9,59.69 v87.63,60.96 | v86.36,58.42 87.63,57.15 87.63,54.61 v86.36,53.34 | v64.77,50.8 64.77,48.26 S35.1
P36  (via drill 0.4)
  Top 0.4: v90.17,50.8 XIOH.2
  Bottom 0.4: v90.17,50.8 76.2,50.8 73.66,48.26 72.39,48.26 S36.1
P37  (via drill 0.4)
  Top 0.4: XIOH.1 96.52,49.53 v96.52,54.61 | v87.63,53.34 85.09,50.8 76.2,50.8 v76.2,49.53
  Bottom 0.4: v96.52,54.61 88.9,54.61 v87.63,53.34 | S37.1 v76.2,49.53
P38
  Bottom 0.4: XIOL.16 87.63,45.72 85.09,48.26 80.01,48.26 S38.1
P39  (via drill 0.4)
  Top 0.4: v87.63,46.99 85.09,49.53 80.01,49.53 S39.1
  Bottom 0.4: XIOL.15 93.98,46.99 v87.63,46.99
P40  (via drill 0.4)
  Top 0.4: v87.63,43.18 87.63,45.72 85.09,48.26 82.55,48.26 S40.1
  Bottom 0.4: v87.63,43.18 XIOL.14
P41
  Bottom 0.4: XIOL.13 93.98,44.45 86.36,44.45 S41.1
P42  (via drill 0.4)
  Top 0.4: v73.66,39.37 71.12,36.83 v53.34,36.83 | v49.53,33.02 52.07,33.02 S42.1
  Bottom 0.4: XIOL.12 93.98,41.91 96.52,41.91 96.52,49.53 78.74,49.53 74.93,45.72 74.93,39.37 v73.66,39.37 | v49.53,33.02 v53.34,36.83
P43  (via drill 0.4)
  Top 0.4: v99.06,12.7 92.71,6.35 69.85,6.35 v69.85,7.62 | v62.23,7.62 57.15,7.62 v57.15,11.43 | v49.53,11.43 46.99,13.97 46.99,24.13 48.26,25.4 v48.26,27.94
  Bottom 0.4: XIOL.11 99.06,36.83 v99.06,12.7 | v62.23,7.62 v69.85,7.62 | v49.53,11.43 v57.15,11.43 | v48.26,27.94 48.26,31.75 49.53,31.75 52.07,34.29 S43.1
P44  (via drill 0.4)
  Top 0.4: XIOL.10 90.17,35.56 v90.17,34.29 | v63.5,34.29 v69.85,34.29
  Bottom 0.4: v90.17,34.29 80.01,34.29 78.74,35.56 71.12,35.56 v69.85,34.29 | v63.5,34.29 59.69,34.29 S44.1
P45
  Bottom 0.4: XIOL.9 93.98,39.37 91.44,39.37 90.17,38.1 86.36,38.1 85.09,36.83 80.01,36.83 78.74,38.1 68.58,38.1 62.23,31.75 S45.1
P46  (via drill 0.4)
  Top 0.4: XIOL.8 91.44,34.29 v91.44,26.67 | v69.85,22.86 67.31,22.86 66.04,21.59 66.04,16.51 63.5,16.51 63.5,21.59 62.23,22.86 v62.23,25.4
  Bottom 0.4: v91.44,26.67 88.9,24.13 78.74,24.13 77.47,22.86 v69.85,22.86 | v62.23,25.4 62.23,30.48 63.5,30.48 S46.1
P47
  Bottom 0.4: XIOL.7 93.98,36.83 86.36,36.83 85.09,35.56 80.01,35.56 78.74,36.83 71.12,36.83 67.31,33.02 S47.1
P48  (via drill 0.4)
  Top 0.4: v87.63,33.02 85.09,35.56 78.74,35.56 v78.74,34.29
  Bottom 0.4: v87.63,33.02 XIOL.6 | v78.74,34.29 72.39,34.29 S48.1
P49  (via drill 0.4)
  Top 0.4: XIOL.5 93.98,34.29 93.98,39.37 v90.17,39.37 | v80.01,38.1 76.2,38.1 v76.2,33.02
  Bottom 0.4: v90.17,39.37 86.36,39.37 85.09,38.1 v80.01,38.1 | v76.2,33.02 74.93,31.75 S49.1
P50  (via drill 0.4)
  Top 0.4: XIOL.4 93.98,29.21 96.52,29.21 96.52,24.13 v77.47,24.13
  Bottom 0.4: v77.47,24.13 74.93,26.67 74.93,30.48 76.2,30.48 S50.1
P51  (via drill 0.4)
  Top 0.4: v86.36,35.56 85.09,36.83 77.47,36.83 77.47,34.29 S51.1
  Bottom 0.4: XIOL.3 93.98,31.75 93.98,34.29 91.44,34.29 90.17,35.56 v86.36,35.56
P52  (via drill 0.4)
  Top 0.4: v87.63,27.94 87.63,31.75 85.09,34.29 82.55,34.29 S52.1
  Bottom 0.4: v87.63,27.94 XIOL.2
P53
  Bottom 0.4: XIOL.1 93.98,29.21 87.63,29.21 S53.1
PSU_VIN
  Top 0.4: J1.PWR D1.A
  Top 0.813: X4.2 2.56,55.9 2.54,55.88 2.54,33.02 12.7,33.02 12.7,28.03 J1.PWR
SV1
  Top 0.813: S18.2 S19.2 S20.2 S21.2 62.23,57.15 62.23,71.12 76.2,71.12 X1.2
SV2
  Top 0.254: X1.4 86.39,77.47
  Top 0.813: S22.2 S23.2 S24.2 S25.2 74.93,57.15 74.93,62.23 87.63,62.23 87.63,74.93 86.36,74.93 X1.4 | 86.39,77.47 86.36,77.47
SV3
  Top 0.813: S26.2 S27.2 S28.2 S29.2 88.9,57.15 88.9,74.93 96.52,74.93 X1.6
SV4
  Top 0.254: 46.99,77.47 46.96,77.5
  Top 0.813: S33.2 S32.2 S31.2 S30.2 46.99,43.18 46.99,77.47 | 46.96,77.5 X2.2
SV5
  Top 0.813: X2.4 54.61,73.66 48.26,73.66 48.26,48.26 62.23,48.26 62.23,43.18 S34.2 S35.2 S36.2 S37.2
SV6
  Top 0.813: S41.2 S40.2 S39.2 S38.2 74.93,43.18 74.93,49.53 49.53,49.53 49.53,72.39 64.77,72.39 X2.6
SV7
  Top 0.813: X3.2 12.7,71.12 43.18,71.12 43.18,29.21 S42.2 S43.2 S44.2 S45.2
SV8
  Top 0.813: X3.4 22.86,72.39 44.45,72.39 44.45,34.29 62.23,34.29 62.23,29.21 S46.2 S47.2 S48.2 S49.2
SV9
  Top 0.813: X3.6 33.02,74.93 45.72,74.93 45.72,35.56 74.93,35.56 74.93,29.21 S50.2 S51.2 S52.2 S53.2
VI  (via drill 0.4)
  Top 0.4: v24.13,16.51 20.32,12.7 U$4.6
  Bottom 0.4: UDN2981.13 30.48,57.15 40.64,57.15 41.91,55.88 41.91,44.45 39.37,44.45 38.1,43.18 38.1,16.51 | 38.1,16.51 38.1,12.7 U$3.6 | v24.13,16.51 38.1,16.51
VIN
  Top 0.813: IR_PWR_SELECT.7 IR_PWR_SELECT.5 | IC1.OUT 5.11,43.2 X4.3 12.68,50.82 12.7,50.8 IR_PWR_SELECT.7 | IR_PWR_SELECT.7 12.7,46.99 C18.1 41.91,46.99 41.91,27.94 44.45,27.94 POWER.6

### Text on the board
tPlace: 9 | 8 | 7 | 6 | 5 | 4 | 3 | 2 | 1 | 0 | 14 | 15 | 16 | 17 | 18 | 19 | 20 | 21 | 22 | 13 | 12 | 11 | 10 | 24 | 26 | 28 | 30 | 31 | 32 | 33 | 34 | 35 | 36 | 37 | 38 | 39 | 40 | 41 | 42 | 43 | 44 | 45 | 46 | 47 | 48 | 49 | 50 | 51 | 52 | 53 | 0 | 1 | 2 | 3 | 4 | 5 | 6 | 7 | 8 | 9 | 10 | 11 | 12 | 13 | 14 | 15
tNames: TX | RX | TX3 | RX3 | TX2 | RX2 | TX1 | RX1 | SDA | SCL | GND | AREF | 5V | GND | GND | RESET | 3V3 | 5V | VIN | GND | Arduino
ReferenceLC: L | TX | RX | PC1 | PC2